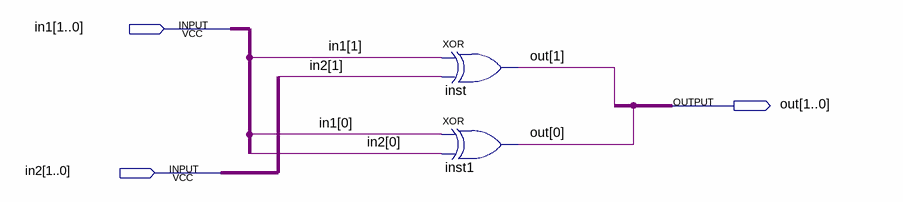
[diagram p0: schematic sheet]
// Quartus schematic 2bitxor.bdf as structural Verilog: 2 symbols, 3 pins
module \2bitxor  (
  input  [1:0] in1,
  input  [1:0] in2,
  output [1:0] out
);

  xor inst (out[1], in1[1], in2[1]);
  xor inst1 (out[0], in1[0], in2[0]);
endmodule
